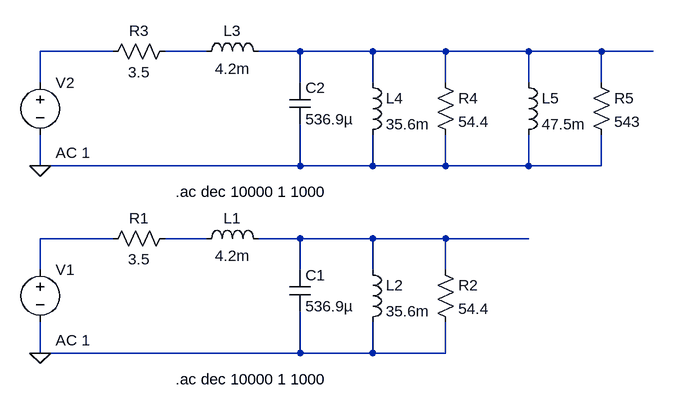
[diagram p0: schematic mounted_thor.asc]
mounted_thor.asc, the LTspice schematic file:
Version 4
SHEET 1 1012 680
WIRE 176 -352 64 -352
WIRE 320 -352 256 -352
WIRE 464 -352 400 -352
WIRE 576 -352 464 -352
WIRE 688 -352 576 -352
WIRE 816 -352 688 -352
WIRE 928 -352 816 -352
WIRE 1008 -352 928 -352
WIRE 64 -304 64 -352
WIRE 464 -304 464 -352
WIRE 576 -304 576 -352
WIRE 688 -304 688 -352
WIRE 816 -304 816 -352
WIRE 928 -304 928 -352
WIRE 64 -176 64 -224
WIRE 464 -176 464 -240
WIRE 464 -176 64 -176
WIRE 576 -176 576 -224
WIRE 576 -176 464 -176
WIRE 688 -176 688 -224
WIRE 688 -176 576 -176
WIRE 816 -176 816 -224
WIRE 816 -176 688 -176
WIRE 928 -176 928 -224
WIRE 928 -176 816 -176
WIRE 176 -64 64 -64
WIRE 320 -64 256 -64
WIRE 464 -64 400 -64
WIRE 576 -64 464 -64
WIRE 688 -64 576 -64
WIRE 816 -64 688 -64
WIRE 64 -16 64 -64
WIRE 464 -16 464 -64
WIRE 576 -16 576 -64
WIRE 688 -16 688 -64
WIRE 64 112 64 64
WIRE 464 112 464 48
WIRE 464 112 64 112
WIRE 576 112 576 64
WIRE 576 112 464 112
WIRE 688 112 688 64
WIRE 688 112 576 112
FLAG 64 112 0
FLAG 64 -176 0
SYMBOL voltage 64 -32 R0
WINDOW 123 24 124 Left 2
WINDOW 39 0 0 Left 0
SYMATTR Value2 AC 1
SYMATTR InstName V1
SYMATTR Value ""
SYMBOL res 272 -80 R90
WINDOW 0 0 56 VBottom 2
WINDOW 3 32 56 VTop 2
SYMATTR InstName R1
SYMATTR Value 3.5
SYMBOL ind 304 -48 R270
WINDOW 0 32 56 VTop 2
WINDOW 3 5 56 VBottom 2
SYMATTR InstName L1
SYMATTR Value 4.2m
SYMBOL cap 448 -16 R0
SYMATTR InstName C1
SYMATTR Value 536.9µ
SYMBOL ind 560 -32 R0
SYMATTR InstName L2
SYMATTR Value 35.6m
SYMBOL res 672 -32 R0
SYMATTR InstName R2
SYMATTR Value 54.4
SYMBOL voltage 64 -320 R0
WINDOW 123 24 124 Left 2
WINDOW 39 0 0 Left 0
SYMATTR Value2 AC 1
SYMATTR InstName V2
SYMATTR Value ""
SYMBOL res 272 -368 R90
WINDOW 0 0 56 VBottom 2
WINDOW 3 32 56 VTop 2
SYMATTR InstName R3
SYMATTR Value 3.5
SYMBOL ind 304 -336 R270
WINDOW 0 32 56 VTop 2
WINDOW 3 5 56 VBottom 2
SYMATTR InstName L3
SYMATTR Value 4.2m
SYMBOL cap 448 -304 R0
SYMATTR InstName C2
SYMATTR Value 536.9µ
SYMBOL ind 560 -320 R0
SYMATTR InstName L4
SYMATTR Value 35.6m
SYMBOL res 672 -320 R0
SYMATTR InstName R4
SYMATTR Value 54.4
SYMBOL res 912 -320 R0
SYMATTR InstName R5
SYMATTR Value 543
SYMBOL ind 800 -320 R0
SYMATTR InstName L5
SYMATTR Value 47.5m
TEXT 272 152 Left 2 !.ac dec 10000 1 1000
TEXT 272 -136 Left 2 !.ac dec 10000 1 1000

The netlist it stands for:
* mounted_thor.asc
V1 N004 0 AC 1
R1 N005 N004 3.5
L1 N005 N006 4.2m
C1 N006 0 536.9µ
L2 N006 0 35.6m
R2 N006 0 54.4
V2 N001 0 AC 1
R3 N002 N001 3.5
L3 N002 N003 4.2m
C2 N003 0 536.9µ
L4 N003 0 35.6m
R4 N003 0 54.4
R5 N003 0 543
L5 N003 0 47.5m
.ac dec 10000 1 1000
.ac dec 10000 1 1000
.backanno
.end